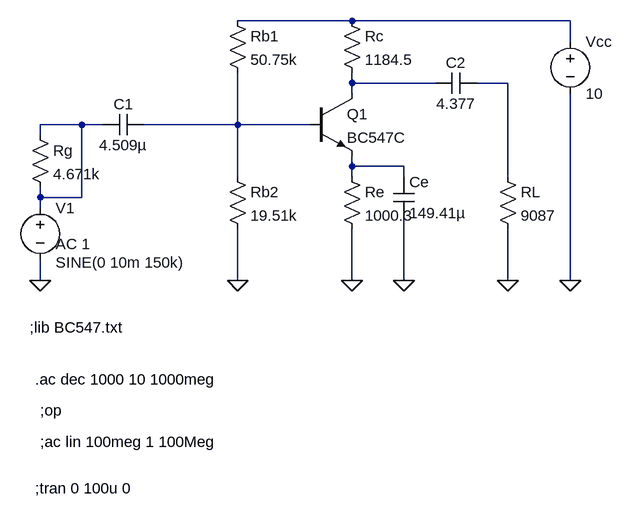
[diagram p0: schematic lab7Scheme.asc]
lab7Scheme.asc, the LTspice schematic file:
Version 4
SHEET 1 880 680
WIRE 64 -80 -112 -80
WIRE 400 -80 64 -80
WIRE 400 -48 400 -80
WIRE 64 16 64 0
WIRE 192 16 64 16
WIRE 304 16 256 16
WIRE 64 32 64 16
WIRE -352 80 -416 80
WIRE -320 80 -352 80
WIRE -112 80 -112 0
WIRE -112 80 -256 80
WIRE 0 80 -112 80
WIRE -416 96 -416 80
WIRE 64 144 64 128
WIRE 144 144 64 144
WIRE -112 160 -112 80
WIRE 64 160 64 144
WIRE 144 160 144 144
WIRE 304 160 304 16
WIRE -416 192 -416 176
WIRE -352 192 -352 80
WIRE -352 192 -416 192
WIRE -416 208 -416 192
WIRE -416 320 -416 288
WIRE -112 320 -112 240
WIRE 64 320 64 240
WIRE 144 320 144 224
WIRE 304 320 304 240
WIRE 400 320 400 32
FLAG -416 320 0
FLAG -112 320 0
FLAG 64 320 0
FLAG 144 320 0
FLAG 304 320 0
FLAG 400 320 0
DATAFLAG 64 144 ""
SYMBOL voltage -416 192 R0
WINDOW 3 24 100 Left 2
WINDOW 123 24 72 Left 2
WINDOW 39 0 0 Left 0
SYMATTR Value SINE(0 10m 150k)
SYMATTR Value2 AC 1
SYMATTR InstName V1
SYMBOL res -432 80 R0
SYMATTR InstName Rg
SYMATTR Value 4.671k
SYMBOL cap -256 64 R90
WINDOW 0 0 32 VBottom 2
WINDOW 3 32 32 VTop 2
SYMATTR InstName C1
SYMATTR Value 4.509µ
SYMBOL res -128 144 R0
SYMATTR InstName Rb2
SYMATTR Value 19.51k
SYMBOL res -128 -96 R0
SYMATTR InstName Rb1
SYMATTR Value 50.75k
SYMBOL npn 0 32 R0
SYMATTR InstName Q1
SYMATTR Value BC547C
SYMBOL res 48 -96 R0
SYMATTR InstName Rc
SYMATTR Value 1184.5
SYMBOL res 48 144 R0
SYMATTR InstName Re
SYMATTR Value 1000.3
SYMBOL cap 256 0 R90
WINDOW 0 0 32 VBottom 2
WINDOW 3 32 32 VTop 2
SYMATTR InstName C2
SYMATTR Value 4.377
SYMBOL cap 128 160 R0
SYMATTR InstName Ce
SYMATTR Value 149.41µ
SYMBOL res 288 144 R0
SYMATTR InstName RL
SYMATTR Value 9087
SYMBOL voltage 400 -64 R0
SYMATTR InstName Vcc
SYMATTR Value 10
TEXT -432 392 Left 2 !;lib BC547.txt
TEXT -424 472 Left 2 !.ac dec 1000 10 1000meg
TEXT -416 520 Left 2 !;op
TEXT -416 568 Left 2 !;ac lin 100meg 1 100Meg
TEXT -424 640 Left 2 !;tran 0 100u 0

The netlist it stands for:
* lab7Scheme.asc
V1 N004 0 SINE(0 10m 150k) AC 1
Rg N004 N004 4.671k
C1 N005 N004 4.509µ
Rb2 N005 0 19.51k
Rb1 N001 N005 50.75k
Q1 N002 N005 N006 0 BC547C
Rc N001 N002 1184.5
Re N006 0 1000.3
C2 N003 N002 4.377
Ce N006 0 149.41µ
RL N003 0 9087
Vcc N001 0 10
.model NPN NPN
.model PNP PNP
.lib standard.bjt
;lib BC547.txt
.ac dec 1000 10 1000meg
;op
;ac lin 100meg 1 100Meg
;tran 0 100u 0
.backanno
.end